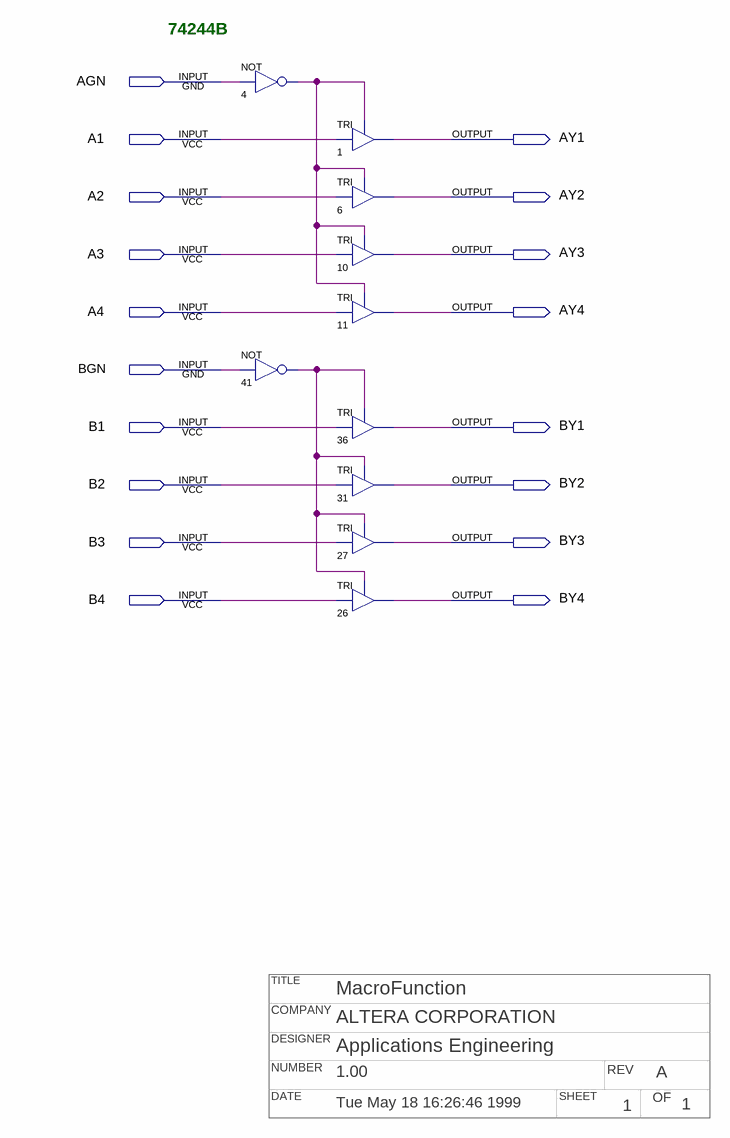
[diagram p0: schematic sheet]
// Quartus schematic 74244b.bdf as structural Verilog: 10 symbols, 18 pins
// Title block: TITLE: MacroFunction; COMPANY: ALTERA CORPORATION; DESIGNER: Applications Engineering; NUMBER: 1.00; REV: A; DATE: Tue May 18 16:26:46 1999; SHEET: 1; OF: 1
module \74244b  (
  input  AGN,
  input  A1,
  input  A2,
  input  A3,
  input  A4,
  input  BGN,
  input  B1,
  input  B2,
  input  B3,
  input  B4,
  output AY1,
  output AY2,
  output AY3,
  output AY4,
  output BY1,
  output BY2,
  output BY3,
  output BY4
);

  wire n4_out, n41_out;

  not u_4 (n4_out, AGN);
  not u_41 (n41_out, BGN);
  TRI u_1 (.IN(A1), .OE(n4_out), .OUT(AY1));
  TRI u_6 (.IN(A2), .OE(n4_out), .OUT(AY2));
  TRI u_10 (.IN(A3), .OE(n4_out), .OUT(AY3));
  TRI u_11 (.IN(A4), .OE(n4_out), .OUT(AY4));
  TRI u_36 (.IN(B1), .OE(n41_out), .OUT(BY1));
  TRI u_31 (.IN(B2), .OE(n41_out), .OUT(BY2));
  TRI u_27 (.IN(B3), .OE(n41_out), .OUT(BY3));
  TRI u_26 (.IN(B4), .OE(n41_out), .OUT(BY4));

  // Notes on the sheet:
  //   74244B
endmodule
